# Altium schematic sheet IMU_ISM330ISN.SchDoc
size 420 x 297 mm; SheetNumber: 6; SheetTotal: 13
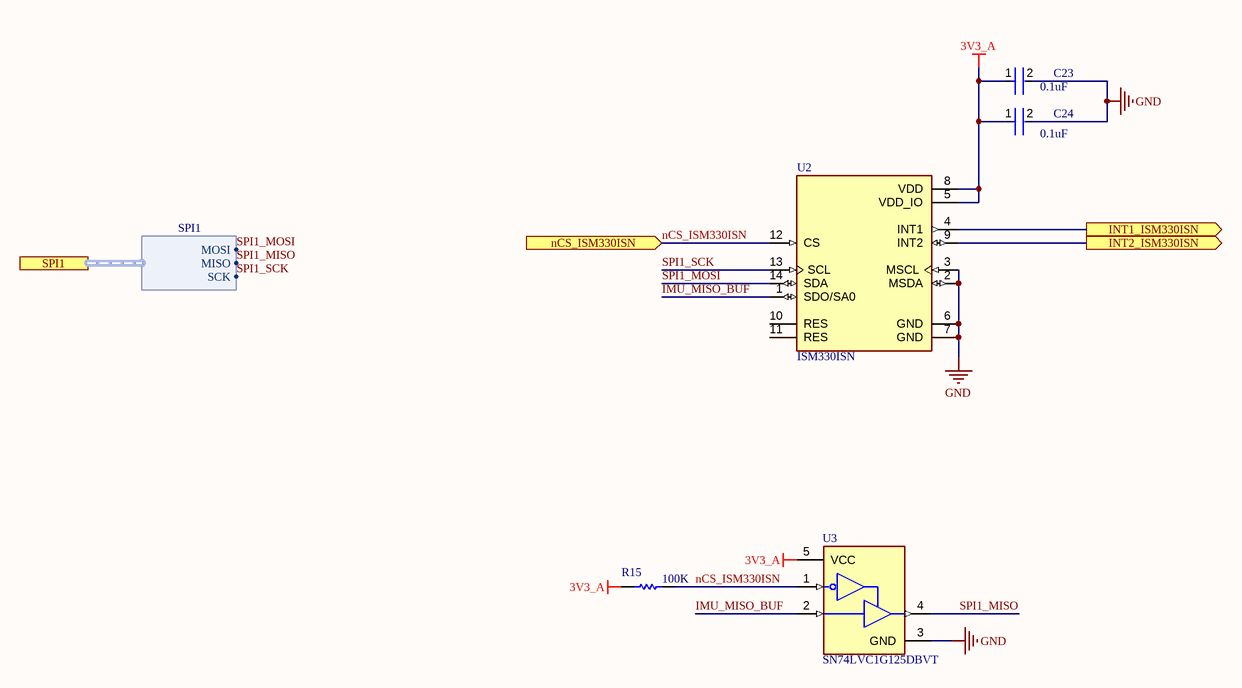
[diagram p0: IMU_ISM330ISN.SchDoc]

## Parts
C23  0.1uF  [FP-C0603C-CF-MFG]
C24  0.1uF  [FP-C0603C-CF-MFG]
R15  100K  [RESC1608X55X30ML20T10]
U2  ISM330ISN  [XDCR_ISM330ISNTR]
U3  SN74LVC1G125DBVT  [FP-DBV0005A-MFG]

## Ports
INT1_ISM330ISN (out), INT2_ISM330ISN (out), nCS_ISM330ISN (in), SPI1 (harness SPI1)

## Harnesses
SPI1: MOSI, MISO, SCK

## Nets
3V3_A: C23.1 C24.1 R15.2 U2.5(VDD_IO) U2.8(VDD) U3.5(VCC)
GND: C23.2 C24.2 U2.2(MSDA) U2.3(MSCL) U2.6(GND) U2.7(GND) U3.3(GND)
IMU_MISO_BUF: U2.1(SDO/SA0) U3.2(A)
INT1_ISM330ISN: U2.4(INT1) ; port INT1_ISM330ISN
INT2_ISM330ISN: U2.9(INT2) ; port INT2_ISM330ISN
nCS_ISM330ISN: R15.1 U2.12(CS) U3.1(~{OE}) ; port nCS_ISM330ISN
SPI1_MISO: U3.4(Y) ; port SPI1.MISO
SPI1_MOSI: U2.14(SDA) ; port SPI1.MOSI
SPI1_SCK: U2.13(SCL) ; port SPI1.SCK

Not connected (* = marked no-connect by the designer): U2 10(RES) 11(RES)

## Notes on the sheet
- THIS DOCUMENT AND THE DATA DISCLOSED HEREIN OR
- HEREWITH IS THE PROPERTY OF ALTIUM LIMITED AND MAY
- DWG NO:
- REVISION
- REV:
- DESCRIPTION
- DATE
- APPROVED
- BE FREELY DISTRIBUTED IN WHOLE. NO RIGHTS ARE
- RESERVED OR EXPRESS OR IMPLIED WARANTEE GIVEN.
- ENG:
- APPROVALS
- PROJECT
- DSN:
- CHK:
- REFERENCE DOCUMENTS
- PROJECT REVISION:
- TITLE
- DOCUMENT REVISION:
- DESIGN ITEM:
- BOM:
- FAB DWG:
- PCB DWG:
- ASSY DWG:
- SCALE:
- A3
- SIZE
- CAGE CODE
- FILE NAME
- DWG NO.
- SHEET
- OF
- REV

## Library data of the parts
C23 C24 = CMP-2006-03061-2: CAP CER 0.1UF 50V X7R 0603; Manufacturer: KEMET; Manufacturer Part Number: C0603C104K5RACTU; Tolerance: 0.1; Temperature Coefficient: 30ppm/°C; Material: Ceramic; Automotive Grade: Grade 1; Value: 0.10 μF; Temperature: -55°C to +125°C; RoHS: TRUE; Temperature Range High: +125°C; Lead Free: Yes; Octopart: https://octopart.com/c0603c104k5ractu-kemet-139244; Digikey Description: CAP CER 0.1UF 50V X7R 0603; Category: Cap; Package: C0603C-CF; ComponentLink2Description: Datasheet; Temperature Range Low: -55°C; Device Class L1: Passive Components; Voltage Rating: 50 V; Automotive: Yes; Device Class L3: Ceramic Capacitors; ComponentLink2URL: https://api.kemet.com/component-edge/download/datasheet/C0603C100J5GACAUTO.pdf; Capacitance: 0.10 μF; Device Class L2: Capacitors; Temperature Characteristic: X7R; Height: 0.87mm
R15 = CMP-2000-01852-1: Part Number: RK73B1JTTD104J; Manufacturer: KOA Speer
U2 = CMP-064-000000-1: Accelerometer, Gyroscope, Temperature, 6 Axis Sensor I2C, SPI Output; MF: STMicroelectronics; SnapEDA_Link: https://www.snapeda.com/parts/ISM330ISNTR/STMicroelectronics/view-part/?ref=snap; Check_prices: https://www.snapeda.com/parts/ISM330ISNTR/STMicroelectronics/view-part/?ref=eda; Package: VFLGA-14 STMicroelectronics; Pin Count: 14; Source: ISM330ISNTR.SchLib; Component Type: Standard; Design Item ID: ISM330ISNTR; Value: *; MP: ISM330ISNTR
U3 = CMP-0859-00018-4: IC BUF NON-INVERT 5.5V SOT23-5; Manufacturer: Texas Instruments; Min Supply Voltage: 1.65V; Number Of Outputs: 1; Propagation Delay: 4.2ns; Logic Function Desc: Non-Inverting; Nominal Supply Current: 10uA; Standoff Height: 0mm; ComponentLink2Description: Datasheet; Temperature Range High: +125°C; Octopart: https://octopart.com/sn74lvc1g125dbvt-texas+instruments-1006799; Ambient Temperature Range Low: -40°C; Temperature: -40°C to +125°C; Mouser Description: Buffers & Line Drivers SNGL Bus Buffer Gate; Automotive: No; RoHS: TRUE; Device Class L2: Logic ICs; Ambient Temperature Range High: +125°C; ComponentLink2URL: http://www.ti.com/lit/ds/symlink/sn74lvc1g125.pdf; Height: 1.45mm; Number Of Circuits: 1; Device Class L1: Integrated Circuits (ICs); Max Supply Voltage: 5.5V; Manufacturer Part Number: SN74LVC1G125DBVT; Temperature Range Low: -40°C; Package: DBV0005A; Device Class L3: Logic Gates; Number Of Inputs: 1; Lead Free: Yes; Category: IC; Digikey Description: IC BUF NON-INVERT 5.5V SOT23-5